# EasyEDA Pro project DC-DC 5V.epro

# Schematic Schematic1
Create Date: 2022-11-20; Page Name: P1; Project Name: DC/DC 5V; Schematic Name: Schematic1; Update Date: 2023-03-21; Company: 嘉立创EDA; Page Size: A4; Version: V1.0
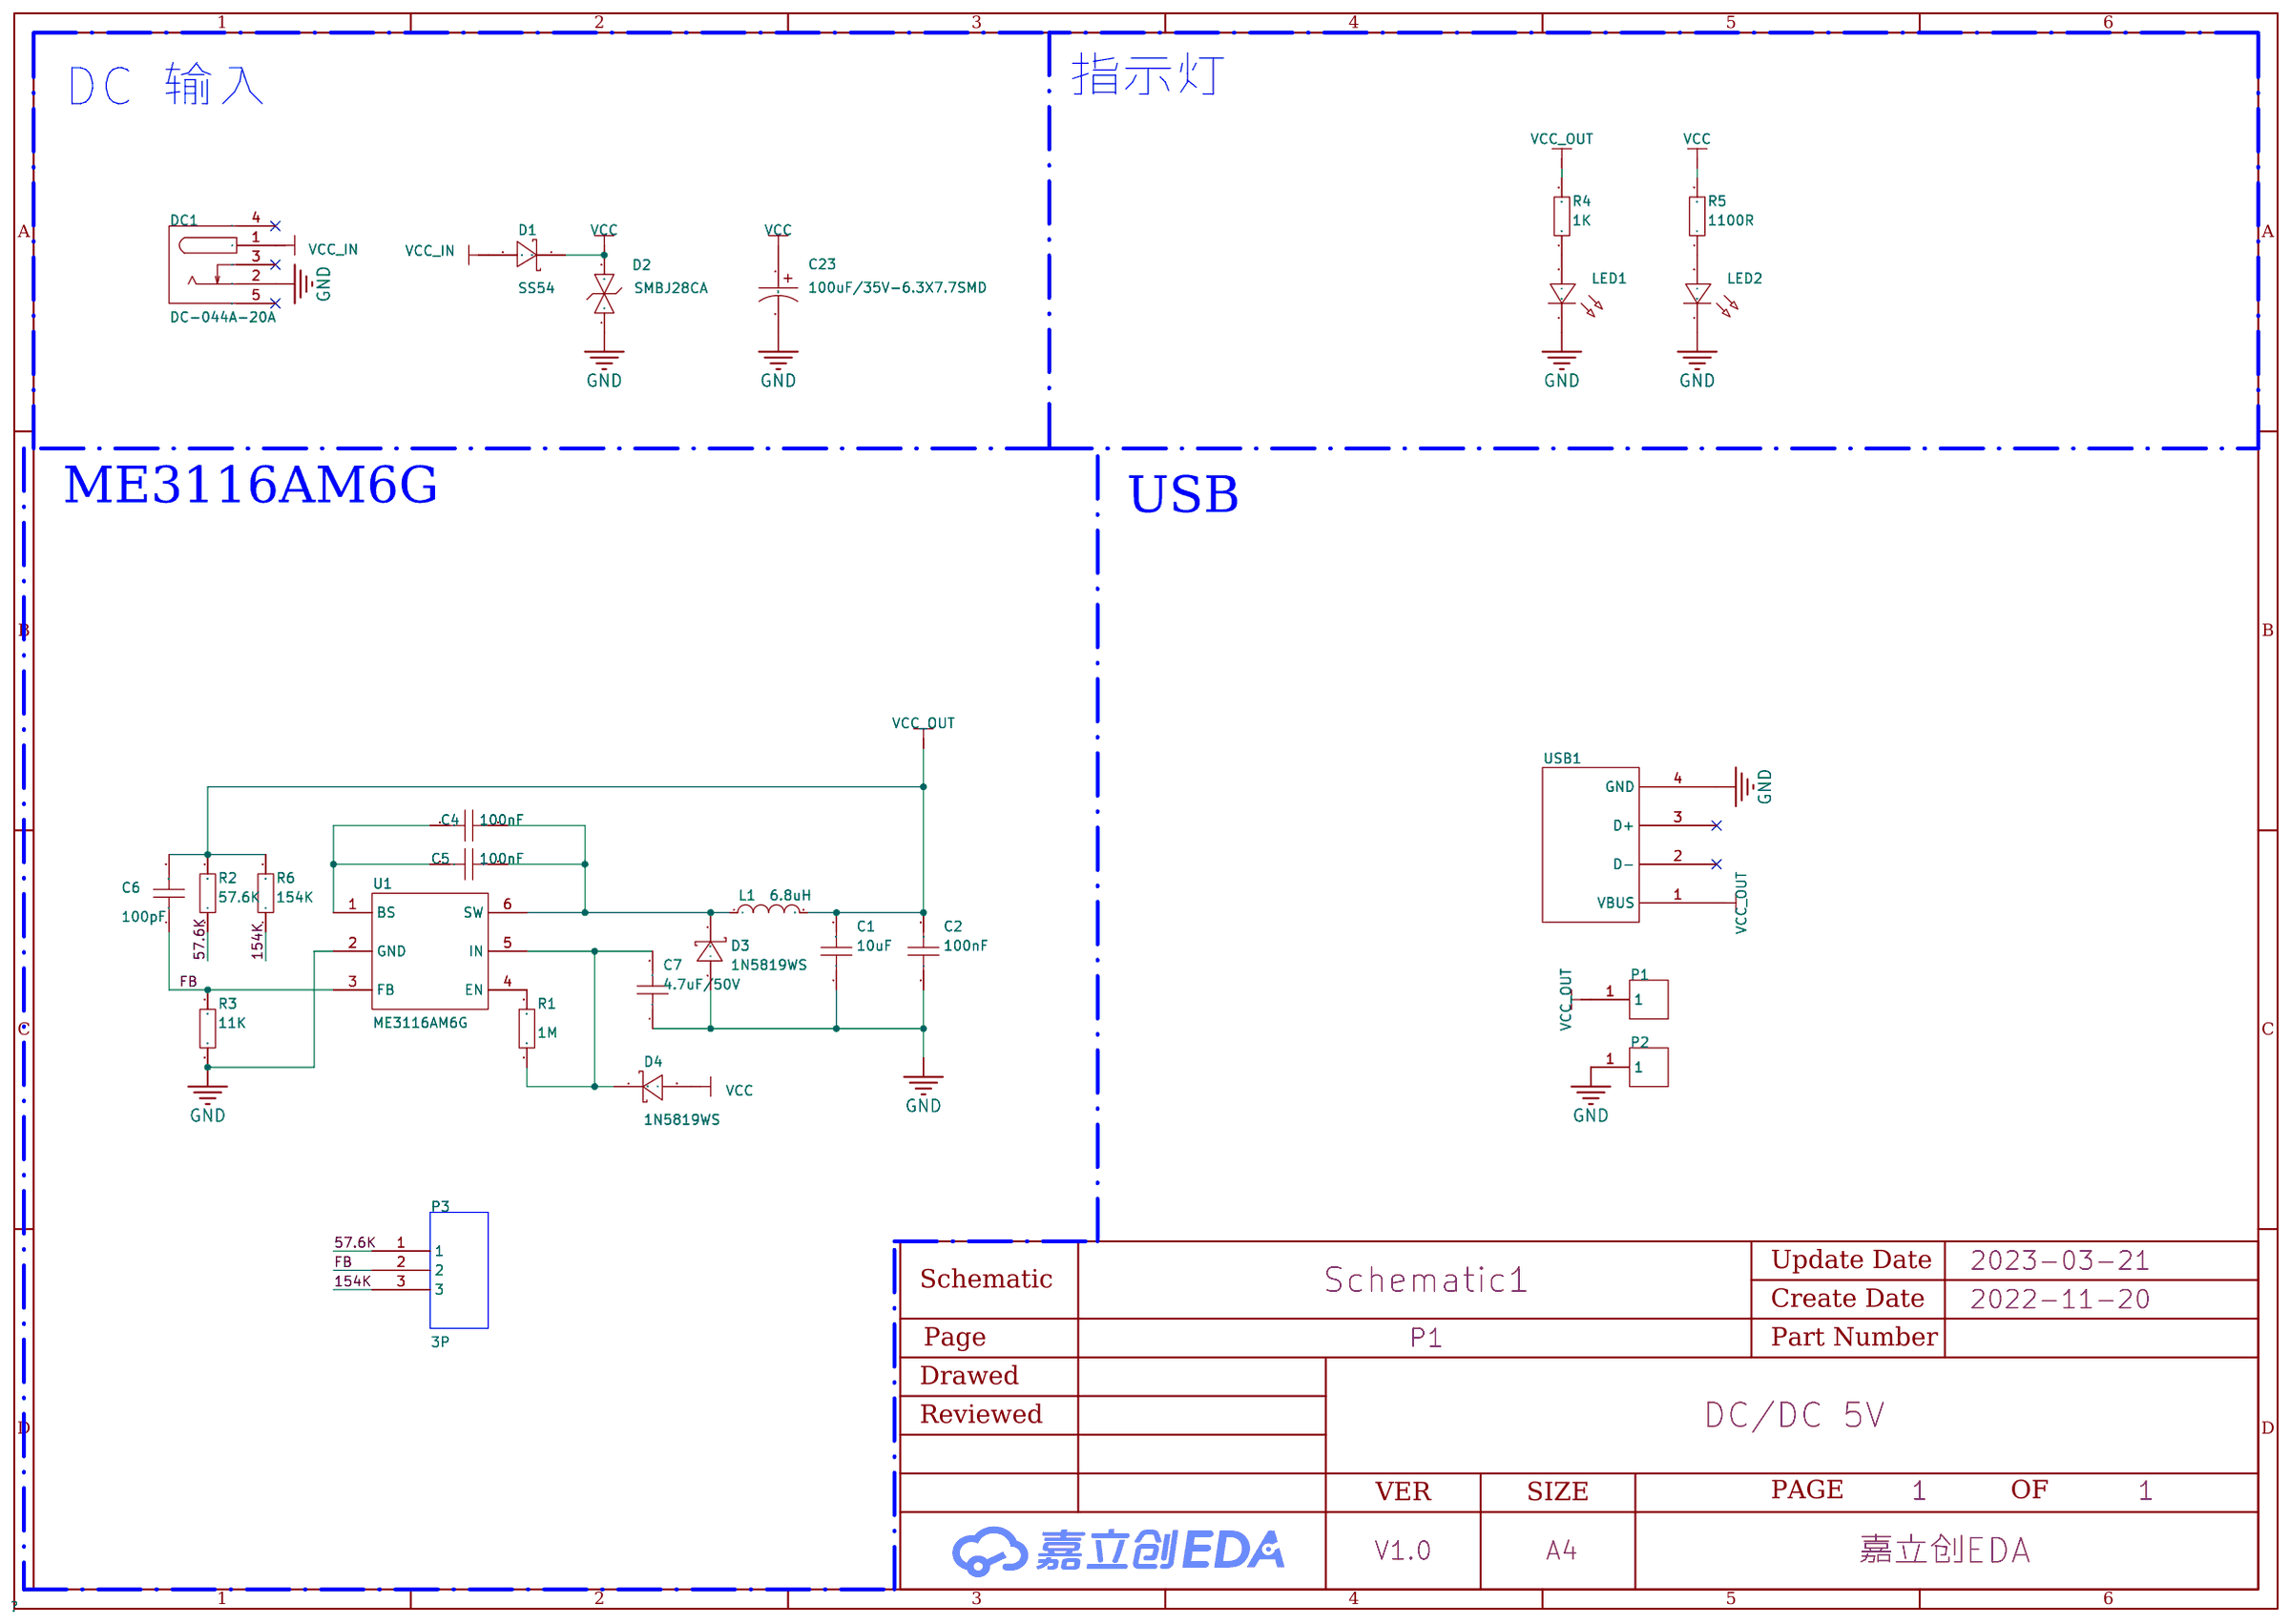
[diagram p0: schematic sheet]

## Parts
C1  100nF  [C0603]
C2  100nF  [C0603]
C4  100nF  [C0603]
C5  100nF  [C0603]
C6  100nF  [C0603]
C7  100nF  [C0805]
C23  100uF/35V-6.3X7.7SMD  [CAP-SMD_BD6.3-L6.6-W6.6-FD]
D1  SS54  [SMA_L4.2-W2.6-LS5.3-RD]
D2  SMBJ28CA  [SMB_L4.6-W3.6-LS5.3-BI]
D3  1N5819WS  [SOD-323_L1.8-W1.3-LS2.5-RD]
D4  1N5819WS  [SOD-323_L1.8-W1.3-LS2.5-RD]
DC1  DC-044A-20A  [DC-IN-TH_DC-044A-20A]
L1  10uH  [IND-SMD_L7.4-W6.6]
LED1  -  [LED0805-RD_RED]
LED2  -  [LED0805-RD_RED]
P1  -  [铜柱 M2]
P2  -  [铜柱 M2]
P3  3P  [Header-3P-2.54]
R1  10K  [R0603]
R2  10K  [R0603]
R3  10K  [R0603]
R4  10K  [R0603]
R5  10K  [R0603]
R6  154K  [R0603]
U1  ME3116AM6G  [SOT-23-6_L2.9-W1.6-P0.95-LS2.8-BR]
USB1  -  [USB-A Short]

## Library data of the parts
C1 C2 C4-C6 = CAP_0603: Supplier Footprint: 0603
C7 = CAP_0805: Supplier Footprint: 0805
C23 = 100uF/35V-6.3X7.7SMD: Supplier Part: C9900004345; Supplier Footprint: 6.3X7.7SMD; JLCPCB Part Class: 扩展库; Datasheet: https://atta.szlcsc.comnull; Supplier: LCSC
D1 = SS54: Supplier Part: C2929944; Manufacturer: CJ(江苏长电/长晶); Supplier Footprint: SMAG; Datasheet: https://atta.szlcsc.com/upload/public/pdf/source/20220614/5F851C6501CD456476EE6414B9DEDB2D.pdf; Supplier: LCSC
D2 = SMBJ28CA_C726872: 极性:双向;; LCSC Part Name: 双向; Supplier Part: C726872; Manufacturer: TWGMC(台湾迪嘉); Supplier Footprint: SMB; JLCPCB Part Class: 扩展库; Datasheet: https://atta.szlcsc.com/upload/public/pdf/source/20200901/C726811_07201DC3516E92FF13903A0BAE18F725.pdf; Supplier: LCSC; Polarity: 双向
D3 D4 = 1N5819WS_C440261: 直流反向耐压(Vr):40V;平均整流电流(Io):1A;正向压降(Vf):900mV@3A;; LCSC Part Name: 40V 1A 900mV@3A; Supplier Part: C440261; Manufacturer: PJSEMI(平晶微); Supplier Footprint: SOD-323; JLCPCB Part Class: 扩展库; Datasheet: https://atta.szlcsc.com/upload/public/pdf/source/20210224/C440261_8032C480D816C9C5CCE6FA0D0539A89A.pdf; Supplier: LCSC; Reverse Voltage (Vr): 40V; Average Rectified Current (Io): 1A; Forward Voltage (Vf@If): 900mV@3A
DC1 = DC-044A-20A: 触点内径:2mm;触点外径:0.9mm;; LCSC Part Name: DC座 内铁芯2.0 11.6mm*10.1mm; Supplier Part: C129006; Manufacturer: 韩国韩荣; Supplier Footprint: Through Hole; JLCPCB Part Class: Extended Part; Datasheet: https://atta.szlcsc.com/upload/public/pdf/source/20210810/C8974B0AB7FDF70EB0A74D74746E6460.pdf; Supplier: LCSC; Inside Contact Diameter: 2mm; Outside Contact Diameter: 0.9mm
L1 = CKST0603-10uH/M: 电感值:10uH;精度:±20%;额定电流:4A;饱和电流(Isat):5A;直流电阻(DCR):68mΩ;; LCSC Part Name: 10uH ±20% 4A 68mΩ; Supplier Part: C3002639; Manufacturer: CENKER(岑科); Supplier Footprint: SMD,7.4x6.6x3mm; JLCPCB Part Class: 扩展库; Datasheet: https://atta.szlcsc.com/upload/public/pdf/source/20220510/B48FE89972EB9627500571FF6CB43AFA.pdf; Supplier: LCSC; Tolerance: ±20%; Rated Current: 4A; Saturation Current (Isat): 5A; DC Resistance (DCR): 68mΩ
LED1 LED2 = LED_0805-G: Supplier Footprint: 0805
P1 P2 = 铜柱 M2
P3 = Header-3P-2.54: 2.54mm 排针
R1-R6 = Res_0603: Supplier Footprint: 0603
U1 = ME3116AM6G_C97643: 功能类型:降压型;同步整流:-;输出通道数:-;拓扑结构:-;输入电压:-;输出电流(最大值):-;开关频率:-;; LCSC Part Name: 降压型; Supplier Part: C97643; Manufacturer: MICRONE(南京微盟); Supplier Footprint: SOT-23-6; JLCPCB Part Class: 扩展库; Datasheet: https://atta.szlcsc.com/upload/public/pdf/source/20170322/1490151692992.pdf; Supplier: LCSC; Function: 降压型
USB1 = USB-A Short

## Nets
GND: C1.1 C2.1 C7.1 C23.2 D2.1 D3.2(A) DC1.2 LED1.1(C) LED2.1(C) P2.1 R3.1 U1.2(GND) USB1.4(GND)
VCC: C23.1 D1.1(C) D2.2 D4.2(A) R5.2
VCC_IN: D1.2(A) DC1.1
VCC_OUT: C1.2 C2.2 C6.2 L1.2 P1.1 R2.2 R4.2 R6.2 USB1.1(VBUS)
57.6K: P3.1 R2.1
154K: P3.3 R6.1
FB: C6.1 P3.2 R3.2 U1.3(FB)
$1N1129: R1.2 U1.4(EN)
$1N1130: C7.2 D4.1(C) R1.1 U1.5(IN)
$1N1131: C4.2 C5.2 U1.1(BS)
$1N1132: C4.1 C5.1 D3.1(C) L1.1 U1.6(SW)
$1N1955: LED1.2(A) R4.1
$1N2249: LED2.2(A) R5.1

Not connected (* = marked no-connect by the designer): DC1 3* 4* 5*; USB1 2(D-)* 3(D+)*

## Notes on the sheet
- DC 输入
- 指示灯
- ME3116AM6G
- USB

# Board PCB1
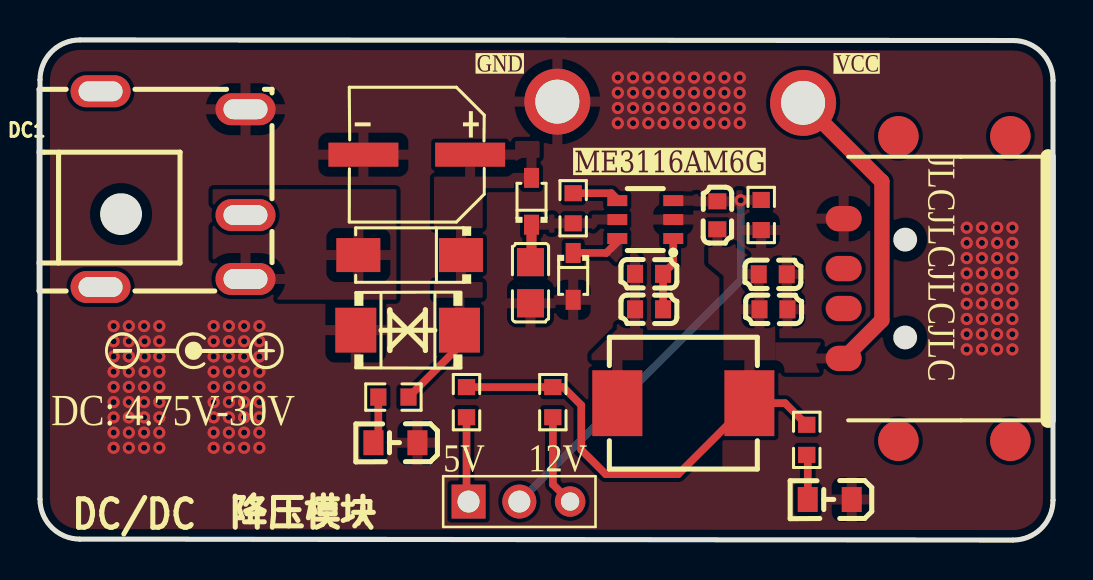
[diagram p1: board, top side]
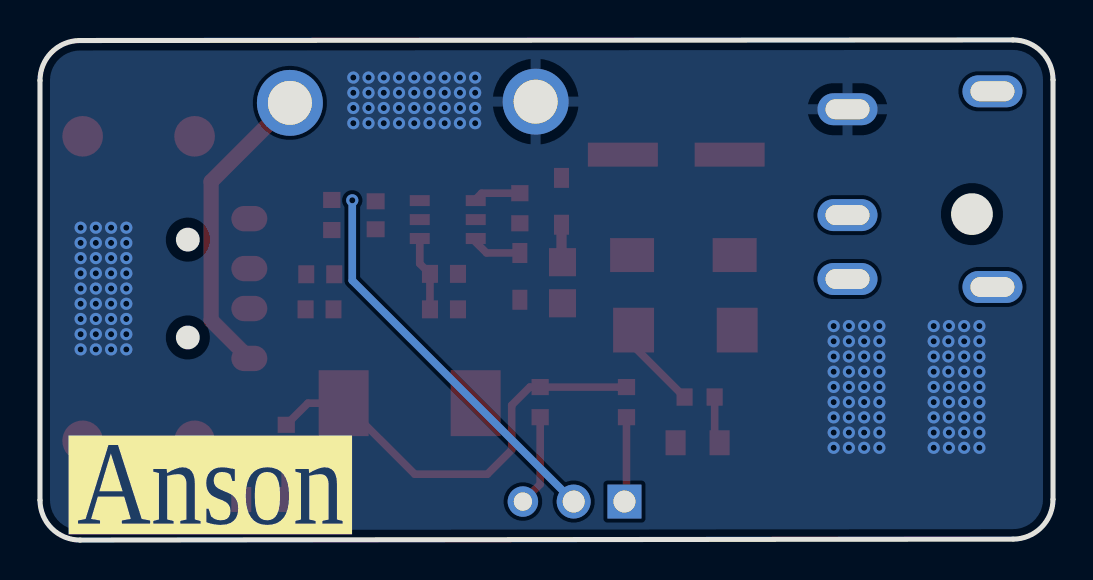
[diagram p2: board, bottom side, seen from below]

Outline 50.67 x 25.05 mm; copper layers: Top Layer, Bottom Layer. Coordinates in mm from the lower left corner of the outline.
Outline path: 0,23.05 arc(0.59,24.46) 2,25.05 48.67,25.02 arc(50.09,24.43) 50.67,23.02 50.67,2 arc(50.09,0.59) 48.67,0 2,0.05 arc(0.59,0.63) 0,2.05 0,23.05
Stack: Top Layer 0.035mm / Dielectric1 1.51mm FR4 er 4.5 / Bottom Layer 0.035mm

## Design rules (mm)
spacing safeClearance (default): track to track 0.152, other pairs 0.152 to 0.3
track width trackWidth (default): min 0.127, default 0.254, max 2.54
differential pair differentialPair (default): width min 0.127, default 0.254, max 2.54; gap min 0.152, default 0.152
via viaSize (default): diameter min 0.5, default 0.61, max 10; hole min 0.3, default 0.305, max 6
net GND uses copperRegion1
net VCC_IN uses copperRegion1
net VCC uses copperRegion1
net $1N1130 uses copperRegion1
net $1N1132 uses copperRegion1
net FB uses copperRegion1
net VCC_OUT uses copperRegion1

## Placement (name value [footprint] x y rotation side)
C1  100nF  [C0603]  36.65 13.31 180 top
C2  100nF  [C0603]  36.69 11.56 180 top
C4  100nF  [C0603]  30.47 11.56 0 top
C5  100nF  [C0603]  30.47 13.33 0 top
C6  100nF  [C0603]  33.88 16.27 270 top
C7  100nF  [C0805]  24.54 12.89 90 top
C23  100uF/35V-6.3X7.7SMD  [CAP-SMD_BD6.3-L6.6-W6.6-FD]  18.85 19.3 180 top
D1  SS54  [SMA_L4.2-W2.6-LS5.3-RD]  18.49 14.27 180 top
D2  SMBJ28CA  [SMB_L4.6-W3.6-LS5.3-BI]  18.39 10.51 0 top
D3  1N5819WS  [SOD-323_L1.8-W1.3-LS2.5-RD]  26.67 13.21 270 top
D4  1N5819WS  [SOD-323_L1.8-W1.3-LS2.5-RD]  24.59 16.97 90 top
DC1  DC-044A-20A  [DC-IN-TH_DC-044A-20A]  6.66 17.58 0 top
L1  10uH  [IND-SMD_L7.4-W6.6]  32.18 6.86 0 top
LED1  -  [LED0805-RD_RED]  39.5 2.03 180 top
LED2  -  [LED0805-RD_RED]  17.78 4.88 180 top
P1  -  [铜柱 M2]  38.17 21.9 0 top
P2  -  [铜柱 M2]  25.88 21.96 0 top
P3  3P  [Header-3P-2.54]  20.17 0.66 0 top
R1  10K  [R0603]  26.67 16.62 90 top
R2  10K  [R0603]  21.34 6.91 90 top
R3  10K  [R0603]  36.08 16.28 90 top
R4  10K  [R0603]  38.35 5.02 90 top
R5  10K  [R0603]  17.68 7.16 0 top
R6  154K  [R0603]  25.65 6.91 90 top
U1  ME3116AM6G  [SOT-23-6_L2.9-W1.6-P0.95-LS2.8-BR]  30.28 16.05 0 top
USB1  -  [USB-A Short]  45.21 12.6 0 top

## Footprints (pads in the part's own frame, mm; a bottom-side part is the same pattern mirrored in y, then rotated)
C0603
  rect 0.8x0.9 smd: 1(-0.7,0) 2(0.7,0)
C0805
  rect 1.41x1.35 smd: 1(-1.03,0) 2(1.03,0)
CAP-SMD_BD6.3-L6.6-W6.6-FD
  rect 3.5x1.2 smd: 1(-2.67,0) 2(2.67,0)
DC-IN-TH_DC-044A-20A
  oval 3x1.6 hole 2.2x1: 1(3.625,-4.5) 2(3.625,4.001) 3(3.625,-1.3) 4(-3.625,-4.9) 5(-3.625,4.9)
Header-3P-2.54
  rect 1.7x1.7 hole 1.1: 1(1.27,1.27)
  round 1.7 hole 1.1: 2(3.81,1.27)
  round 1.524 hole 0.914: 3(6.35,1.27)
IND-SMD_L7.4-W6.6
  rect 2.499x3.3 smd: 1(-3.302,0) 2(3.302,0)
LED0805-RD_RED
  rect 1x1.25 smd: 1(-1.1,0) 2(1.1,0)
R0603
  rect 0.806x0.864 smd: 1(-0.753,0) 2(0.753,0)
SMA_L4.2-W2.6-LS5.3-RD
  rect 2.2x1.7 smd: 1(-2.566,0) 2(2.566,0)
SMB_L4.6-W3.6-LS5.3-BI
  rect 2.047x2.241 smd: 1(-2.591,0) 2(2.591,0)
SOD-323_L1.8-W1.3-LS2.5-RD
  rect 1x0.75 smd: 1(-1.173,0) 2(1.173,0)
SOT-23-6_L2.9-W1.6-P0.95-LS2.8-BR
  rect 1x0.55 smd: 1(1.4,-0.95) 2(1.4,0) 3(1.4,0.95) 4(-1.4,0.95) 5(-1.4,0) 6(-1.4,-0.95)
USB-A Short
  rrect 2.032x2.032 smd: 0(-2.273,7.625) 0(-2.273,-7.625) 0(3.327,7.625) 0(3.327,-7.625)
  rrect 1.8x1.27 smd: 1(-5.011,-3.5) 2(-5.011,-1) 3(-5.011,1) 4(-5.011,3.5)
铜柱 M2
  round 3.3 hole 2.2: 1(0,0)

## Nets
As in the schematic.

Pads without a net: DC1 3 4 5; USB1 0 2 3

## Via types
v1: diameter 0.61, hole 0.305, Top Layer to Bottom Layer, 145 vias

## Routing (per net, layer and track width the routed paths; a pad name or vN(x,y) marks a point on that pad's centre or on a via; arc(x,y) is an arc through that point)
GND:
  vias: v1(3.68,10.72) v1(3.68,9.96) v1(3.68,9.19) v1(3.68,8.43) v1(3.68,7.67) v1(3.68,6.91) v1(3.68,6.15) v1(3.68,5.38) v1(3.68,4.62) v1(4.44,10.72) v1(4.44,9.95) v1(4.44,9.19) v1(4.44,8.43) v1(4.44,7.67) v1(4.44,6.91) v1(4.44,6.15) v1(4.44,5.38) v1(4.44,4.62) v1(5.21,10.72) v1(5.23,9.96) v1(5.23,9.19) v1(5.23,8.43) v1(5.21,7.67) v1(5.21,6.91) v1(5.21,6.15) v1(5.21,5.38) v1(5.21,4.62) v1(5.97,10.72) v1(5.97,9.96) v1(5.97,9.19) v1(5.97,8.43) v1(5.97,7.67) v1(5.97,6.91) v1(5.97,6.15) v1(5.97,5.38) v1(5.97,4.62) v1(8.69,10.72) v1(8.69,9.96) v1(8.69,9.19) v1(8.69,8.43) v1(8.69,7.67) v1(8.69,6.91) v1(8.69,6.15) v1(8.69,5.38) v1(8.69,4.62) v1(9.45,10.72) v1(9.45,9.95) v1(9.45,9.19) v1(9.45,8.43) v1(9.45,7.67) v1(9.45,6.91) v1(9.45,6.15) v1(9.45,5.38) v1(9.45,4.62) v1(10.21,10.72) v1(10.21,9.96) v1(10.21,9.19) v1(10.21,8.43) v1(10.21,7.67) v1(10.21,6.91) v1(10.21,6.15) v1(10.21,5.38) v1(10.21,4.62) v1(10.97,10.72) v1(10.97,9.96) v1(10.97,9.19) v1(10.97,8.43) v1(10.97,7.67) v1(10.97,6.91) v1(10.97,6.15) v1(10.97,5.38) v1(10.97,4.62) v1(28.91,23.16) v1(28.91,22.4) v1(28.91,21.64) v1(28.91,20.88) v1(29.67,23.16) v1(29.67,22.4) v1(29.67,21.64) v1(29.67,20.88) v1(30.43,23.16) v1(30.43,22.4) v1(30.43,21.64) v1(30.43,20.88) v1(31.19,23.16) v1(31.19,22.4) v1(31.19,21.64) v1(31.19,20.88) v1(31.95,23.16) v1(31.95,22.4) v1(31.95,21.64) v1(31.95,20.88) v1(32.72,23.16) v1(32.72,22.4) v1(32.72,21.64) v1(32.72,20.88) v1(33.48,23.16) v1(33.48,22.4) v1(33.48,21.64) v1(33.48,20.88) v1(34.24,23.16) v1(34.24,22.4) v1(34.24,21.64) v1(34.24,20.88) v1(35,23.16) v1(35,22.4) v1(35,21.64) v1(35,20.88) v1(46.35,15.64) v1(46.35,14.88) v1(46.35,14.12) v1(46.35,13.36) v1(46.35,12.6) v1(46.35,11.83) v1(46.35,11.07) v1(46.35,10.31) v1(46.35,9.55) v1(47.12,15.64) v1(47.12,14.88) v1(47.12,14.12) v1(47.12,13.36) v1(47.12,12.6) v1(47.12,11.84) v1(47.12,11.07) v1(47.12,10.31) v1(47.12,9.55) v1(47.88,15.64) v1(47.88,14.88) v1(47.88,14.12) v1(47.88,13.36) v1(47.88,12.6) v1(47.88,11.83) v1(47.88,11.07) v1(47.88,10.31) v1(47.88,9.55) v1(48.64,15.64) v1(48.64,14.88) v1(48.64,14.12) v1(48.64,13.36) v1(48.64,12.6) v1(48.64,11.83) v1(48.64,11.07) v1(48.64,10.31) v1(48.64,9.55)
VCC: length 4.4
  Top Layer w0.381: D2.2 20.98,9.71 R5.2
VCC_OUT: length 36.7
  Top Layer w0.381: R2.2 R6.2 26.17,7.66 27.08,6.75 27.08,4.52 28.3,3.3 31.93,3.3 35.11,6.48 ; L1.2 37.27,6.86 R4.2
  Top Layer w0.762: P1.1 42.11,17.95 42.11,11.01 USB1.1
57.6K: length 4.2
  Top Layer w0.381: R2.1 21.34,1.93
154K: length 4.6
  Top Layer w0.381: P3.3 25.65,2.79 R6.1
FB: length 19.7
  Bottom Layer w0.381: P3.2 35.05,13 v1(35.05,17.02)
$1N1129: length 2.5
  Top Layer w0.381: 29,16.95 28.58,17.37 R1.2
$1N1130: length 1.8
  Top Layer w0.508: D4.1 24.59,13.97
$1N1131: length 3.8
  Top Layer w0.381: C4.2 C5.2 31.68,13.84 U1.1
$1N1132: length 2.6
  Top Layer w0.381: 29,15.05 28.33,14.38 D3.1
$1N1955: length 2.3
  Top Layer w0.381: R4.1 38.41,4.21 38.41,2.03
$1N2249: length 2.3
  Top Layer w0.381: R5.1 16.93,4.88

## Copper pours and planes (outline as drawn; the poured copper is in the pictures)
GND on Top Layer: -0.1,25.2 51,25.2 51,-0.05 -0.1,-0.05
GND on Bottom Layer: -0.06,25.2 51,25.2 51,0.05 -0.06,0.05
VCC on Top Layer: 19.71,20.01 22.15,20.01 22.15,9.4 19.71,9.4
VCC on Top Layer: 21.78,19.99 24.99,19.99 24.99,17.63 21.78,17.63
VCC_IN on Top Layer: 8.63,17.58 17.83,17.58 17.83,12.04 8.63,12.04
VCC_OUT on Top Layer: 33.43,16 34.8,16 34.8,14.64 36.33,13.78 36.37,11.1 36.78,10.69 36.78,5.13 34.24,5.13 34.19,5.18 34.19,13.24 33.43,13.87
VCC_OUT on Top Layer: 34.49,9.9 41.15,9.9 41.15,8.38 34.49,8.38
FB on Top Layer: 31.14,17.32 32.82,17.32 33.02,17.52 36.58,17.52 36.58,16.56 33.03,16.56 32.88,16.71 31.14,16.71
$1N1130 on Top Layer: 29.55,16.31 29.55,15.69 29.54,15.69 28.5,15.69 28.5,15.7 27.84,15.7 27.53,15.39 24.18,15.39 24.18,16.3
$1N1132 on Top Layer: 28.35,15.39 29.41,15.39 29.41,14.78 30.15,14.05 30.17,14.05 30.17,5.13 30.18,5.13 27.63,5.13 27.58,5.18 27.58,9.29 28.85,10.56 28.85,13.86 28.33,14.38 28.33,15.38

## Text on the board
Bottom Silkscreen Layer: Anson
Top Silkscreen Layer: GND | VCC | 5V | 12V | JLCJLCJLCJLC | DC: 4.75V-30V | ME3116AM6G | DC/DC  降压模块
